# Altium schematic sheet 3-MCU.SCHDOC
size A4
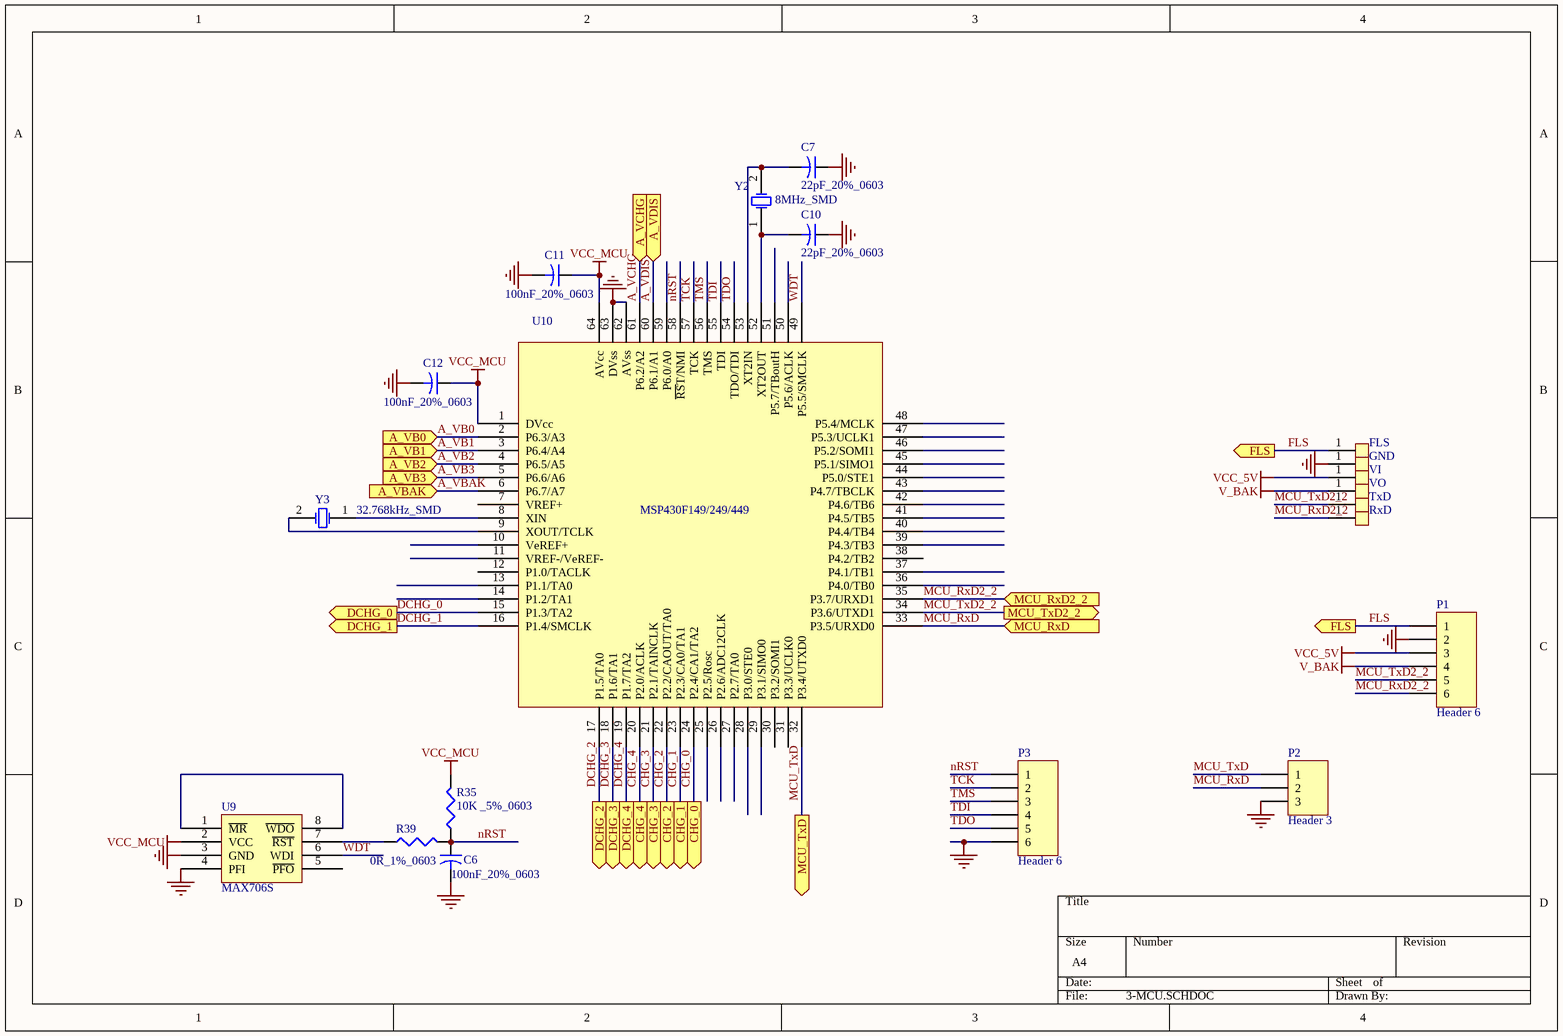
[diagram p0: 3-MCU.SCHDOC]

## Parts
C6  100nF_20%_0603  [C1608-0603]
C7  22pF_20%_0603  [C1608-0603]
C10  22pF_20%_0603  [C1608-0603]
C11  100nF_20%_0603  [C1608-0603]
C12  100nF_20%_0603  [C1608-0603]
FLS  ND  [END_1.5_2.8]  (value not drawn)
GND  ND  [END_1.5_2.8]  (value not drawn)
P1  Header 6  [XH-06H]
P2  Header 3  [XH-03H]
P3  Header 6  [SH-06S]
R35  10K _5%_0603  [C1608-0603]
R39  0R_1%_0603  [C1608-0603]
RxD  ND  [END_1.5_2.8]  (value not drawn)
TxD  ND  [END_1.5_2.8]  (value not drawn)
U9  MAX706S  [SO-8]
U10  MSP430F149/249/449  [QFP-64]
VI  ND  [END_1.5_2.8]  (value not drawn)
VO  ND  [END_1.5_2.8]  (value not drawn)
Y2  8MHz_SMD  [XTAL-P4mm_SMD]
Y3  32.768kHz_SMD  [XTAL-3216]

## Ports
A_VB0 (in), A_VB1 (in), A_VB2 (in), A_VB3 (in), A_VBAK (in), A_VCHG (in), A_VDIS (in), CHG_0 (out), CHG_1 (out), CHG_2 (out), CHG_3 (out), CHG_4 (out), DCHG_0 (out), DCHG_1 (out), DCHG_2 (out), DCHG_3 (out), DCHG_4 (out), FLS (out), MCU_RxD2_2 (in), MCU_RxD (in), MCU_TxD2_2 (out), MCU_TxD (out)

## Nets
GND: C6.2 C7.1 C10.1 C11.2 C12.2 GND.1(SW) P1.2 P2.3 P3.6 U9.3(GND) U9.4(PFI) U10.62(AVss) U10.63(DVss)
V_BAK: P1.4 VO.1(SW)
VCC_5V: P1.3 VI.1(SW)
VCC_MCU: C11.1 C12.1 R35.2 U9.2(VCC) U10.1(DVcc) U10.64(AVcc)
A_VB0: U10.2(P6.3/A3) ; port A_VB0
A_VB1: U10.3(P6.4/A4) ; port A_VB1
A_VB2: U10.4(P6.5/A5) ; port A_VB2
A_VB3: U10.5(P6.6/A6) ; port A_VB3
A_VBAK: U10.6(P6.7/A7) ; port A_VBAK
A_VCHG: U10.61(P6.2/A2) ; port A_VCHG
A_VDIS: U10.60(P6.1/A1) ; port A_VDIS
CHG_0: U10.24(P2.4/CA1/TA2) ; port CHG_0
CHG_1: U10.23(P2.3/CA0/TA1) ; port CHG_1
CHG_2: U10.22(P2.2/CAOUT/TA0) ; port CHG_2
CHG_3: U10.21(P2.1/TAINCLK) ; port CHG_3
CHG_4: U10.20(P2.0/ACLK) ; port CHG_4
DCHG_0: U10.15(P1.3/TA2) ; port DCHG_0
DCHG_1: U10.16(P1.4/SMCLK) ; port DCHG_1
DCHG_2: U10.17(P1.5/TA0) ; port DCHG_2
DCHG_3: U10.18(P1.6/TA1) ; port DCHG_3
DCHG_4: U10.19(P1.7/TA2) ; port DCHG_4
FLS: FLS.1(SW) P1.1 ; port FLS
MCU_RxD: P2.2 U10.33(P3.5/URXD0) ; port MCU_RxD
MCU_RxD2_2: P1.6 RxD.1(SW) U10.35(P3.7/URXD1) ; port MCU_RxD2_2
MCU_TxD: P2.1 U10.32(P3.4/UTXD0) ; port MCU_TxD
MCU_TxD2_2: P1.5 TxD.1(SW) U10.34(P3.6/UTXD1) ; port MCU_TxD2_2
nRST: C6.1 P3.1 R35.1 R39.2 U10.58(~{RS}T/NMI)
TCK: P3.2 U10.57(TCK)
TDI: P3.4 U10.55(TDI)
TDO: P3.5 U10.54(TDO/TDI)
TMS: P3.3 U10.56(TMS)
WDT: U9.6(WDI) U10.49(P5.5/SMCLK)
NetC7_2: C7.2 U10.53(XT2IN) Y2.2(OSC2)
NetC10_2: C10.2 U10.52(XT2OUT) Y2.1(OSC1)
NetR39_1: R39.1 U9.7(~{RST})
NetU9_1: U9.1(~{MR}) U9.8(~{WDO})
NetU10_8: U10.8(XIN) Y3.1(OSC1)
NetU10_9: U10.9(XOUT/TCLK) Y3.2(OSC2)

Not connected (* = marked no-connect by the designer): U9 5(~{PFO}); U10 7(VREF+) 10(VeREF+) 11(VREF-/VeREF-) 12(P1.0/TACLK) 13(P1.1/TA0) 14(P1.2/TA1) 25(P2.5/Rosc) 26(P2.6/ADC12CLK) 27(P2.7/TA0) 28(P3.0/STE0) 29(P3.1/SIMO0) 30(P3.2/SOMI1) 31(P3.3/UCLK0) 36(P4.0/TB0) 37(P4.1/TB1) 38(P4.2/TB2) 39(P4.3/TB3) 40(P4.4/TB4) 41(P4.5/TB5) 42(P4.6/TB6) 43(P4.7/TBCLK) 44(P5.0/STE1) 45(P5.1/SIMO1) 46(P5.2/SOMI1) 47(P5.3/UCLK1) 48(P5.4/MCLK) 50(P5.6/ACLK) 51(P5.7/TBoutH) 59(P6.0/A0)

## Library data of the parts
C6 = Cap2: Capacitor; Value: 0.1uF 0603; Published: 23-Sep-2002; Publisher: Altium Limited
C7 C10-C12 = Cap2: Capacitor; Value: 0.1uF 20% 0603; Published: 23-Sep-2002; Publisher: Altium Limited
P1 P3 = Header 6: Header, 6-Pin; LatestRevisionDate: 17-Jul-2002; LatestRevisionNote: Re-released for DXP Platform.; Publisher: Altium Limited
P2 = Header 3: Header, 3-Pin; LatestRevisionDate: 17-Jul-2002; LatestRevisionNote: Re-released for DXP Platform.; Publisher: Altium Limited
R35 R39 = Res3: Resistor; Value: 1M %5 0603_NC; Published: 8-Jun-2000; Revision: July-2002: Re-released for DXP Platform.; Publisher: Altium Limited
U9 = MAX706
Y2 Y3 = XTAL: Crystal Oscillator; Published: 8-Jun-2000; Revision: July-2002: Re-released for DXP Platform.; Publisher: Altium Limited